# Altium schematic sheet [05] External Modules.SchDoc
size A4; SheetNumber: 5; SheetTotal: 6
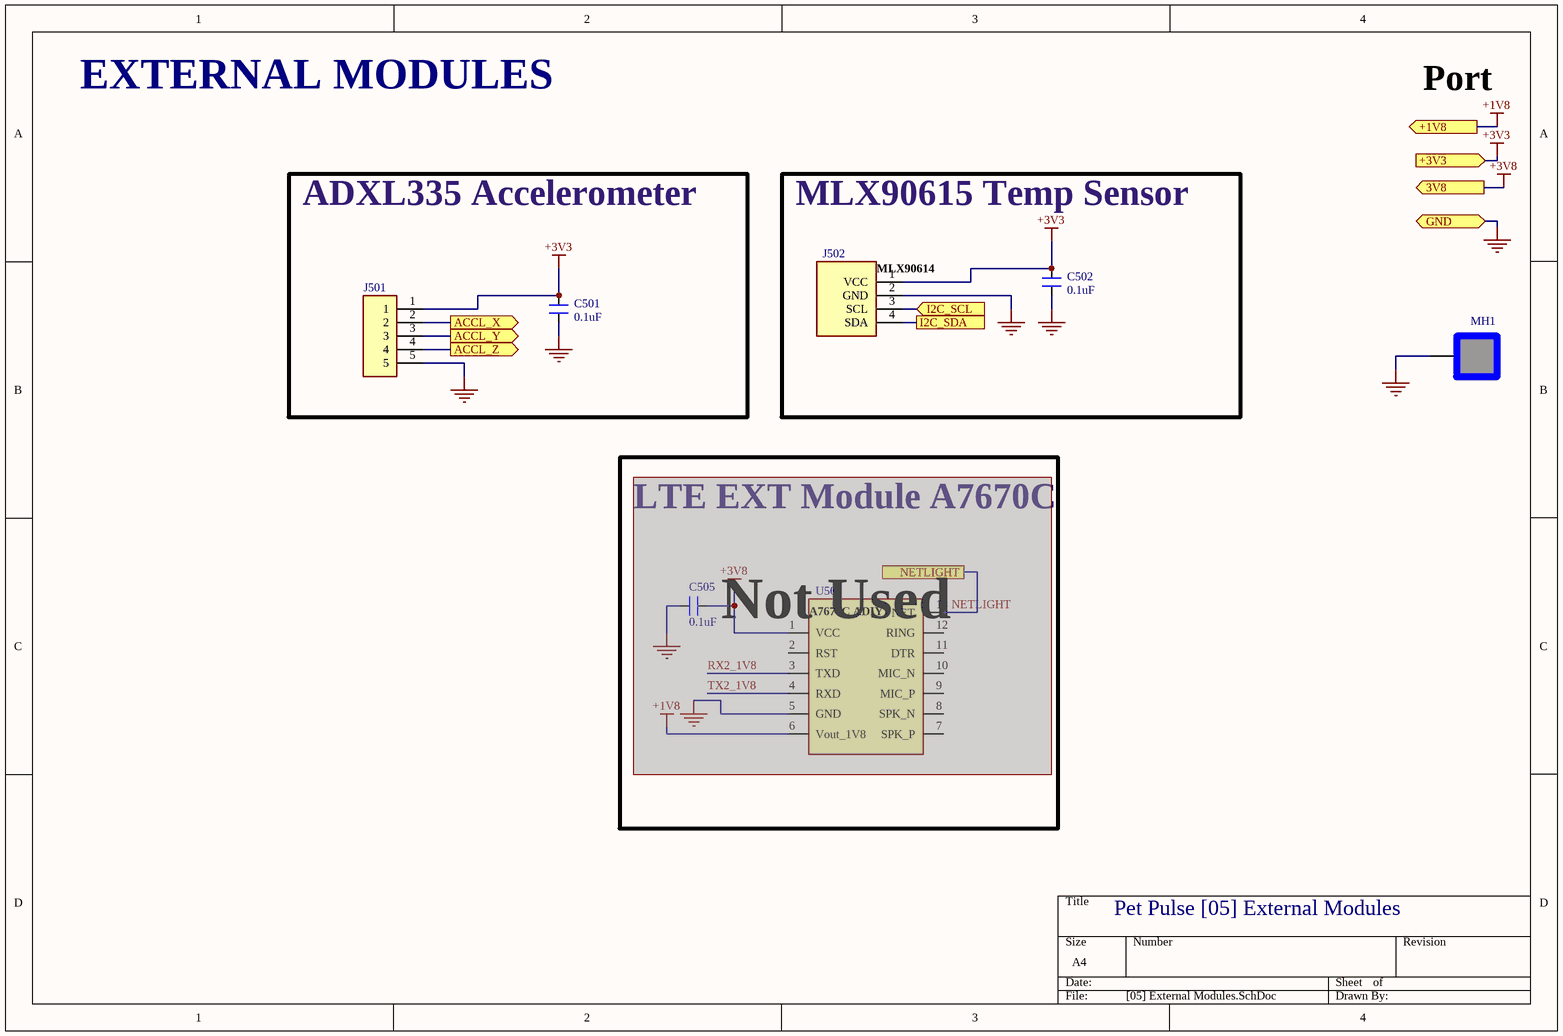
[diagram p0: [05] External Modules.SchDoc]

## Parts
C501  0.1uF  [CAP_0805]
C502  0.1uF  [CAP_0805]
C505  0.1uF  [CAP_0805]  (masked out: inside a compile mask, not in the netlist)
J501  1X5 Berg Male  [CON-BS-SMD-1X5-2.54-M-TH]  (value not drawn)
J502  1X4 Berg Male With MLX90614 3D Body  [MOD_IR_MLX90614_WITH_CON-BS-SMD-1X4-2.54-M-TH]  (value not drawn)
MH1  MH_Square_4MMC_2.2MMD  [MH_Square_4mm_2.2mmD]  (value not drawn)  (no BOM)
U502  A7670C_MOD  [MOD_ADIY_A7670C_BreakoutBoard]  (value not drawn)  (masked out: inside a compile mask, not in the netlist)

## Blocks framed on the sheet
ADXL335 Accelerometer: C501 J501
MLX90615 Temp Sensor: C502 J502
Not Used: C505 U502

## Ports
3V8 (out, see [02] LDO and LiPo Circuit[4A], [06] LTE - A7670C[8A]), +1V8 (out, see [06] LTE - A7670C[8B]), +3V3 (in, see [02] LDO and LiPo Circuit[4A], [03] ESP32[2C], [04] GPS[4A], [06] LTE - A7670C[8A]), ACCL_X (out, see [03] ESP32[4B]), ACCL_Y (out, see [03] ESP32[4B]), ACCL_Z (out, see [03] ESP32[4B]), GND (bidir, see [02] LDO and LiPo Circuit[4A], [03] ESP32[2C], [04] GPS[4A], [06] LTE - A7670C[8A]), I2C_SCL (in, see [03] ESP32[4B], [04] GPS[1B]), I2C_SDA (see [03] ESP32[4B], [04] GPS[1B]), NETLIGHT (see [06] LTE - A7670C[1D], [06] LTE - A7670C[4B])

## Nets
+1V8: port +1V8
+3V3: C501.2 C502.2 J501.1 J502.1(VCC) ; port +3V3
+3V8: port 3V8
GND: C501.1 C502.1 J501.5 J502.2(GND) MH1.1 ; port GND
ACCL_X: J501.2 ; port ACCL_X
ACCL_Y: J501.3 ; port ACCL_Y
ACCL_Z: J501.4 ; port ACCL_Z
I2C_SCL: J502.3(SCL) ; port I2C_SCL
I2C_SDA: J502.4(SDA) ; port I2C_SDA

## Notes on the sheet
- EXTERNAL MODULES
- Port
- LTE EXT Module A7670C
- Pet Pulse [05] External Modules
- (in symbol MOD-ADIY_A7670C_LTE_Breakout_Board) A7670C ADIY
- (in symbol MOD_IR_MLX90614_WITH_CON-BS-SMD-1X4-2.54-M-TH) MLX90614

## Library data of the parts
C501 C502 = CAP_0.1uF-50V-10%-0805: 0.1µF ±10% 50V Ceramic Capacitor X7R 0805 (2012 Metric); Manufacturer: Samsung; Manufacturer Part Number: CL21B104KBCNNNC; Alternate Part Number-1: NA; Case/Package: 0805; Supplier-1: SIRICOM; Supplier Part Number-1: 0805B104K500CT
C505 = CAP_0.1uF-50V-5%-0805: 0.1µF ±5% 50V Ceramic Capacitor X7R 0805 (2012 Metric); Manufacturer: AVX Corporation; Manufacturer Part Number: 08055C104JAT4A; Alternate Part Number-1: 0805B104M500; Case/Package: 0805; Supplier-1: SIRICOM; Supplier Part Number-1: 0805B104J500CT
J501 = CON-BS-SMD-1X5-2.54-M-TH_1: 1X5 Berg Strip SMD Male Conn 2.54mm; Manufacturer: Amphenol Communications Solutions; Manufacturer Part Number: 10129380-905001ALF; Supplier 1: Digi-Key; RoHS: No; Category: Connectors; Stock 1: 5335; Pricing 1: 1=1.00000, 10=0.84300, 100=0.75660, 500=0.61902 (USD); Supplier Part Number 1: 609-4535-1-ND
J502 = MOD_IR_MLX90614_WITH_CON-BS-SMD-1X4-2.54-M-TH: 1X4 Berg Strip SMD Male Conn 2.54mm with 3D body of MLX90614 IR Temperature Sensor; Manufacturer: Amphenol Communications Solutions; Manufacturer Part Number: 10129380-904001ALF; Supplier 1: Digi-Key; RoHS: No; Category: Connectors; Stock 1: 5335; Pricing 1: 1=1.00000, 10=0.84300, 100=0.75660, 500=0.61902 (USD); Supplier Part Number 1: 609-4535-1-ND
MH1 = MH_Square_4MMC_2.2MMD: Mounting Hole 4mm Side, 2.2mm Drill
U502 = MOD-ADIY_A7670C_LTE_Breakout_Board: ADIY LTE Module A7670C